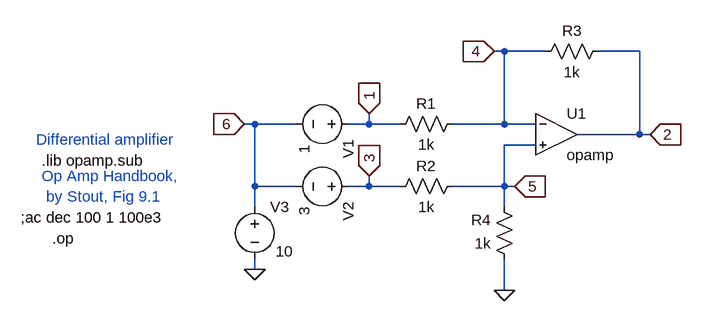
[diagram p0: schematic differntial amplifier.asc]
differntial amplifier.asc, the LTspice schematic file:
Version 4
SHEET 1 880 680
WIRE 112 16 96 16
WIRE 176 16 112 16
WIRE 320 16 256 16
WIRE -272 128 -288 128
WIRE -208 128 -272 128
WIRE -96 128 -96 112
WIRE -96 128 -128 128
WIRE -48 128 -96 128
WIRE 112 128 112 16
WIRE 112 128 32 128
WIRE 160 128 112 128
WIRE 320 144 320 16
WIRE 320 144 224 144
WIRE 336 144 320 144
WIRE 160 160 112 160
WIRE -272 224 -272 128
WIRE -208 224 -272 224
WIRE -96 224 -96 208
WIRE -96 224 -128 224
WIRE -48 224 -96 224
WIRE 112 224 112 160
WIRE 112 224 32 224
WIRE 128 224 112 224
WIRE -272 256 -272 224
WIRE 112 256 112 224
WIRE -272 352 -272 336
WIRE 112 384 112 336
FLAG 112 384 0
FLAG -96 112 1
IOPIN -96 112 In
FLAG 128 224 5
IOPIN 128 224 In
FLAG 96 16 4
IOPIN 96 16 In
FLAG -288 128 6
IOPIN -288 128 In
FLAG 336 144 2
IOPIN 336 144 In
FLAG -96 208 3
IOPIN -96 208 In
FLAG -272 352 0
SYMBOL OpAmps\\opamp 192 80 R0
SYMATTR InstName U1
SYMBOL voltage -112 128 R90
WINDOW 123 27 88 Left 2
WINDOW 39 0 0 Left 0
WINDOW 3 32 84 Left 2
SYMATTR Value 1
SYMATTR InstName V1
SYMBOL res 48 112 R90
WINDOW 0 0 56 VBottom 2
WINDOW 3 32 56 VTop 2
SYMATTR InstName R1
SYMATTR Value 1k
SYMBOL res 272 0 R90
WINDOW 0 0 56 VBottom 2
WINDOW 3 32 56 VTop 2
SYMATTR InstName R3
SYMATTR Value 1k
SYMBOL res 128 352 R180
WINDOW 0 36 76 Left 2
WINDOW 3 36 40 Left 2
SYMATTR InstName R4
SYMATTR Value 1k
SYMBOL res 48 208 R90
WINDOW 0 0 56 VBottom 2
WINDOW 3 32 56 VTop 2
SYMATTR InstName R2
SYMATTR Value 1k
SYMBOL voltage -112 224 R90
WINDOW 123 27 88 Left 2
WINDOW 39 0 0 Left 0
WINDOW 3 32 84 Left 2
SYMATTR Value 3
SYMATTR InstName V2
SYMBOL voltage -272 240 R0
WINDOW 123 27 88 Left 2
WINDOW 39 0 0 Left 0
WINDOW 3 32 84 Left 2
SYMATTR Value 10
SYMATTR InstName V3
TEXT -600 184 Left 2 !.lib opamp.sub
TEXT -600 208 Left 2 ;Op Amp Handbook,\n by Stout, Fig 9.1
TEXT -632 272 Left 2 !;ac dec 100 1 100e3
TEXT -608 152 Left 2 ;Differential amplifier
TEXT -584 304 Left 2 !.op

The netlist it stands for:
* differntial amplifier.asc
XU1 4 5 2 opamp Aol=100K GBW=10Meg  ; pins invin noninvin out
V1 1 6 1
R1 4 1 1k
R3 2 4 1k
R4 0 5 1k
R2 5 3 1k
V2 3 6 3
V3 6 0 10
.lib opamp.sub
* Op Amp Handbook,
*  by Stout, Fig 9.1
;ac dec 100 1 100e3
* Differential amplifier
.op
.backanno
.end